# EAGLE design espThrottle (EAGLE 9.6.2)
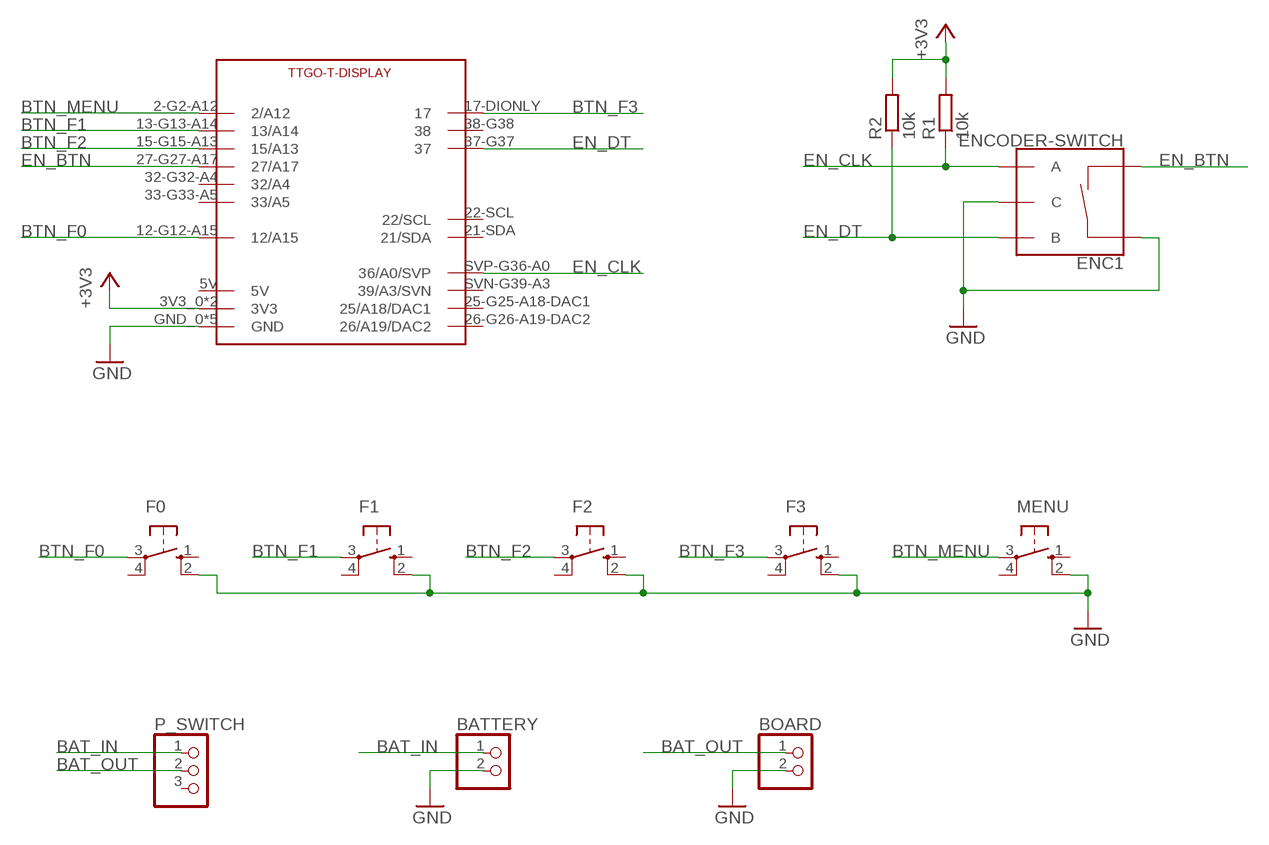
[diagram p0: schematic, sheet 1]

## Parts
BATTERY  PINHD-1X2  [1X02]
BOARD  PINHD-1X2  [1X02]
ENC1  ENCODER-SWITCH  [ROTARY_ENC_PLAIN]
F0  10-XX  [B3F-10XX]
F1  10-XX  [B3F-10XX]
F2  10-XX  [B3F-10XX]
F3  10-XX  [B3F-10XX]
MENU  10-XX  [B3F-10XX]
P_SWITCH  PINHD-1X3  [1X03]
R1  10k  R-EU_0207/12  [0207/12]
R2  10k  R-EU_0207/12  [0207/12]
U$1  TTGO-T-DISPLAYFRAME  [TTGO-T-DISPLAY-OL]

## Nets
+3V3: R1.2 R2.2 U$1.3V3_0(3V3) U$1.3V3_1(3V3)
BAT_IN: BATTERY.1 P_SWITCH.1
BAT_OUT: BOARD.1 P_SWITCH.2
BTN_F0: F0.3(P) U$1.12-G12-A15(12/A15)
BTN_F1: F1.3(P) U$1.13-G13-A14(13/A14)
BTN_F2: F2.3(P) U$1.15-G15-A13(15/A13)
BTN_F3: F3.3(P) U$1.17-DIONLY
BTN_MENU: MENU.3(P) U$1.2-G2-A12(2/A12)
EN_BTN: ENC1.SW- U$1.27-G27-A17(27/A17)
EN_CLK: ENC1.A R1.1 U$1.SVP-G36-A0(36/A0/SVP)
EN_DT: ENC1.B R2.1 U$1.37-G37
GND: BATTERY.2 BOARD.2 ENC1.C ENC1.SW+ F0.2(S1) F1.2(S1) F2.2(S1) F3.2(S1) MENU.2(S1) U$1.GND_0(GND) U$1.GND_1(GND) U$1.GND_2(GND) U$1.GND_3(GND) U$1.GND_4(GND)
Unconnected: F0.1(S) F0.4(P1) F1.1(S) F1.4(P1) F2.1(S) F2.4(P1) F3.1(S) F3.4(P1) MENU.1(S) MENU.4(P1) P_SWITCH.3 U$1.21-SDA(21/SDA) U$1.22-SCL(22/SCL) U$1.25-G25-A18-DAC1(25/A18/DAC1) U$1.26-G26-A19-DAC2(26/A19/DAC2) U$1.32-G32-A4(32/A4) U$1.33-G33-A5(33/A5) U$1.38-G38 U$1.SVN-G39-A3(39/A3/SVN)

## Power pins joined to a net without a drawn wire
5V: U$1.5V

## Library data of the parts
BATTERY BOARD = pinhead:PINHD-1X2: PIN HEADER
ENC1 = SparkFun-Switches:ENCODER-SWITCH: Rotary Encoder w/ Select Switch Encoders rotate similarly to potentiometers, but they’re different from potentiometers in that an encoder has full rotation without limits. They output gray code so that you can tell how much and in which direction the encoder has been turned. This encoder includes a push-down select switch built into the shaft. SparkFun Products Rotary Encoder <https://www.sparkfun.com/products/9117> (COM-09117); SF_SKU: COM-09117
F0 F1-F3 MENU = switch-omron:10-XX: OMRON SWITCH; MPN: B3F-1000; OC_FARNELL: 176432; OC_NEWARK: 36M3542
P_SWITCH = pinhead:PINHD-1X3: PIN HEADER
R1 R2 = rcl:R-EU_: RESISTOR, European symbol; SPICEPREFIX: R
U$1 = TTGO-TDisplay:TTGO-T-DISPLAY: TTGO-TDisplay https://github.com/Xinyuan-LilyGO/TTGO-T-Display

## Net classes
0 default: width 0.254 mm

## Board
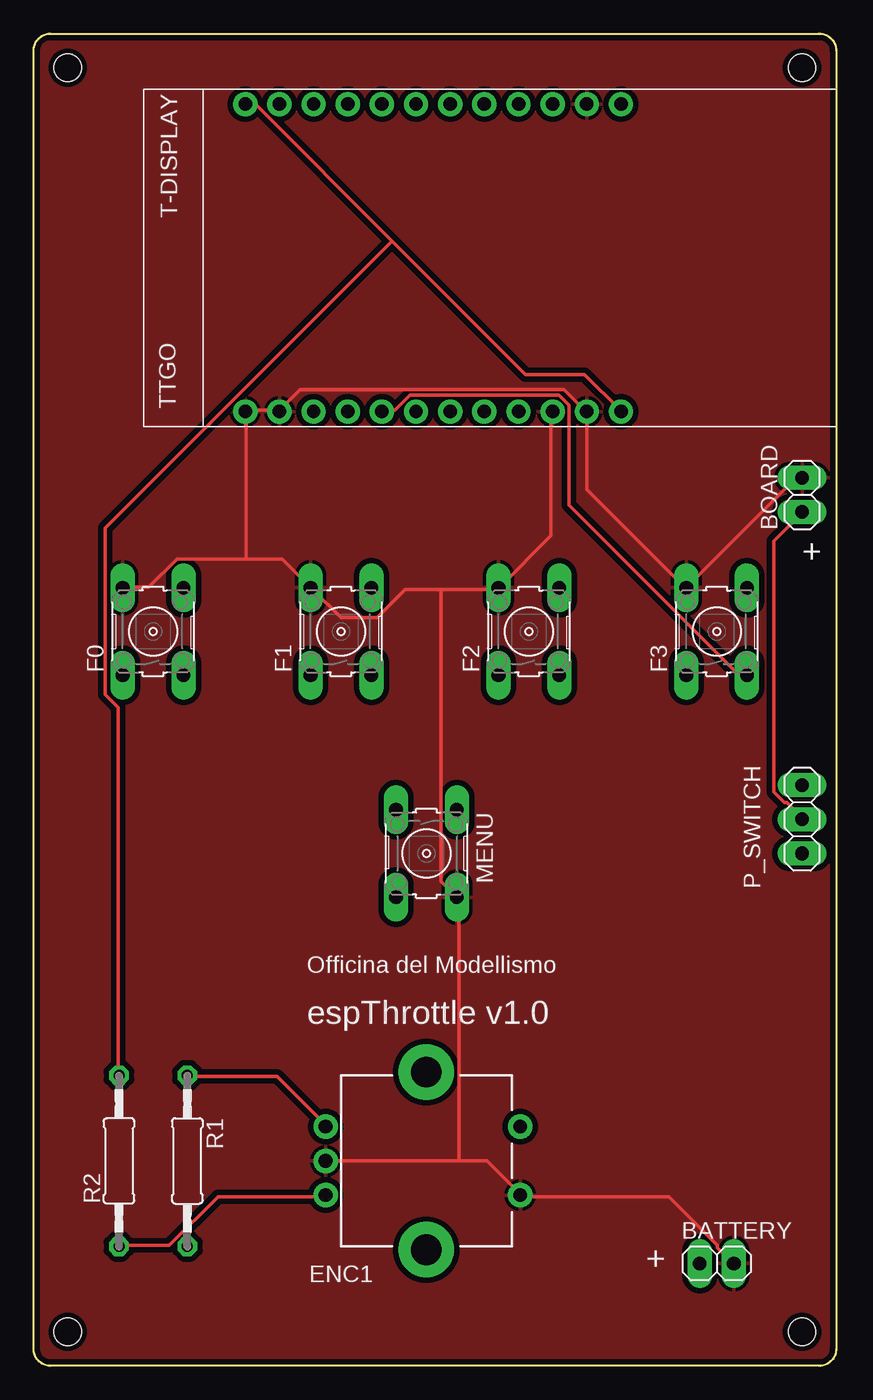
[diagram p1: board, top side]
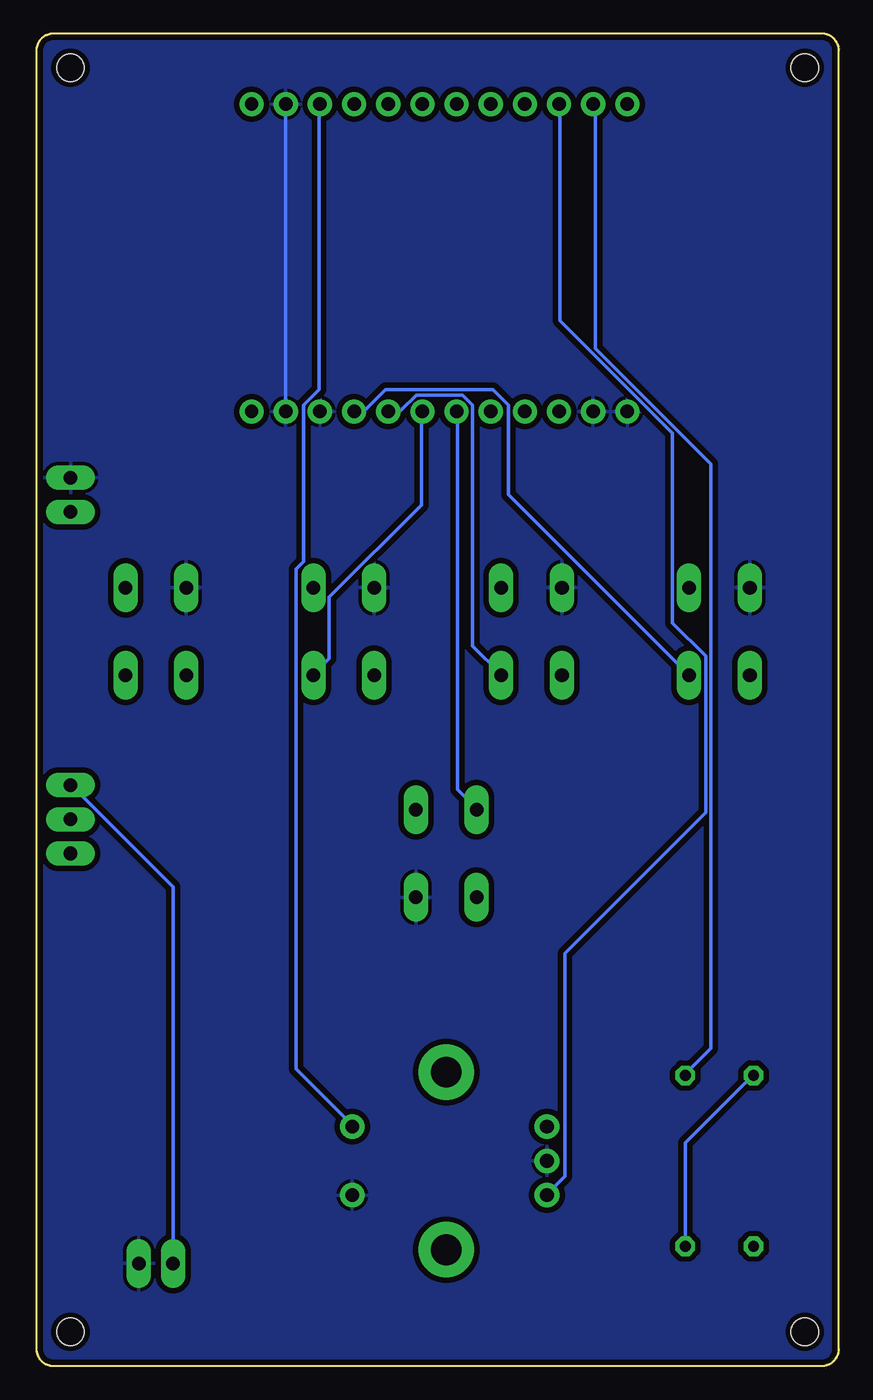
[diagram p2: board, bottom side, seen from below]

Size 59.69 x 99.06 mm. Coordinates in mm from the lower left corner, seen from the top.
Outline: 0,97.79 arc-90 1.27,99.06 58.42,99.06 arc-90 59.69,97.79 59.69,1.27 arc-90 58.42,0 1.27,0 arc-90 0,1.27 0,97.79
Copper layers (1*16): Top 0.035mm / dielectric 1.6mm / Bottom 0.035mm
Design rules "jlcpcb-2layers": minimum track width 5mil, minimum drill 0.3mm, track to track 5mil, track to pad 5mil, pad to pad 5mil, via to via 5mil, smd to smd 5mil, copper to edge 0.2mm, drill to drill 6mil, minimum pad ring 10mil, minimum via ring 3mil, stop-mask expansion 4mil, vias tented up to drill 0mil, thermal gap 10mil
Holes 2.03 mm at 2.54,2.54 2.54,96.52 57.15,96.52 57.15,2.54

### Footprints (pad centres in the part's own frame; a part is rotated, then mirrored left to right if it is on the bottom)
1X02 = drill 1.016 long: 1 -1.27,0; 2 1.27,0
ROTARY_ENC_PLAIN = drill 1.016: A 7.493,-2.54; B 7.493,2.54; C 7.493,0; SW+ -6.985,2.54; SW- -6.985,-2.54 | drill 2.286: P$3 0,6.604; P$4 0,-6.604
B3F-10XX = drill 1.016 long: 1 -3.251,2.261; 2 3.251,2.261; 3 -3.251,-2.261; 4 3.251,-2.261
1X03 = drill 1.016 long: 1 -2.54,0; 2 0,0; 3 2.54,0
0207/12 = drill 0.813 octagon: 1 -6.35,0; 2 6.35,0
TTGO-T-DISPLAY-OL = drill 1 pad 1.78: 2-G2-A12 1.11,31.25; 3V3_0 1.11,16.01; 3V3_1 23.97,43.95; 5V 23.97,16.01; 12-G12-A15 1.11,23.63; 13-G13-A14 1.11,26.17; 15-G15-A13 1.11,28.71; 17-DIONLY 1.11,33.79; 21-SDA 1.11,38.87; 22-SCL 1.11,36.33; 25-G25-A18-DAC1 23.97,26.17; 26-G26-A19-DAC2 23.97,23.63; 27-G27-A17 23.97,21.09; 32-G32-A4 23.97,31.25; 33-G33-A5 23.97,28.71; 37-G37 23.97,38.87; 38-G38 23.97,36.33; GND_0 1.11,43.95; GND_1 1.11,41.41; GND_2 1.11,21.09; GND_3 1.11,18.55; GND_4 23.97,18.55; SVN-G39-A3 23.97,33.79; SVP-G36-A0 23.97,41.41

### Placement (x,y rotation side)
BATTERY  50.8,7.62 0 top
BOARD  57.15,64.77 90 top
ENC1  29.21,15.24 180 top
F0  8.89,54.61 90 top
F1  22.86,54.61 90 top
F2  36.83,54.61 90 top
F3  50.8,54.61 90 top
MENU  29.21,38.1 270 top
P_SWITCH  57.15,40.64 270 top
R1  11.43,15.24 270 top
R2  6.35,15.24 90 top
U$1  59.69,69.85 90 top

### Tracks (layer width: path | path; a pad name or v marks a point on that pad's centre or on a via)
+3V3
  Top 0.254: 26.67,83.63 36.58,73.72 40.96,73.72 43.62,71.06 U$1.3V3_0 | 26.67,83.63 16.57,93.73 15.81,93.73 U$1.3V3_1 | 26.67,83.63 5.33,62.29 5.33,49.91 6.29,48.96 6.29,21.72 R2.2
  Bottom 0.254: R1.2 11.43,16.57 6.48,21.53 R2.2
BAT_IN
  Bottom 0.254: BATTERY.1 49.53,35.62 57.15,43.24 P_SWITCH.1
BAT_OUT
  Top 0.254: P_SWITCH.2 57.15,40.77 56.01,41.91 55.82,41.91 55.05,42.67 55.05,61.34 57.15,63.44 BOARD.1
BTN_F0
  Bottom 0.254: U$1.12-G12-A15 36,71.06 35.24,71.06 33.72,72.58 25.72,72.58 24.57,71.44 24.57,64.77 11.24,51.44 F0.3
BTN_F1
  Bottom 0.254: U$1.13-G13-A14 33.34,71.06 32.58,71.06 31.43,72.2 28,72.2 27.24,71.44 27.24,53.53 25.15,51.44 F1.3
BTN_F2
  Bottom 0.254: U$1.15-G15-A13 31.05,70.87 31.05,64.01 37.91,57.15 37.91,52.58 39.05,51.44 F2.3
BTN_F3
  Top 0.254: U$1.17-DIONLY 25.91,71.06 26.86,71.06 28,72.2 39.05,72.2 39.82,71.44 39.82,64.01 52.39,51.44 52.96,51.44 F3.3
BTN_MENU
  Bottom 0.254: U$1.2-G2-A12 28.38,70.87 28.38,42.86 27.05,41.53 MENU.3
EN_BTN
  Bottom 0.254: U$1.27-G27-A17 38.67,93.73 38.67,72.58 39.82,71.44 39.82,59.82 40.39,59.24 40.39,22.1 36.2,17.91 ENC1.SW-
EN_CLK
  Top 0.254: R1.1 11.43,21.53 18.1,21.53 21.72,17.91 ENC1.A
  Bottom 0.254: U$1.SVP-G36-A0 18.1,93.73 18.1,75.63 9.53,67.06 9.53,23.62 11.43,21.72 R1.1
EN_DT
  Top 0.254: R2.1 6.48,8.95 10.1,8.95 13.72,12.57 21.72,12.57 ENC1.B
  Bottom 0.254: U$1.37-G37 20.76,93.73 20.76,77.72 12.38,69.34 12.38,55.24 9.91,52.77 9.91,41.15 20.38,30.67 20.38,14.1 21.72,12.76 ENC1.B
GND
  Top 0.254: BOARD.2 57.15,65.91 56.58,65.91 48.58,57.91 F3.2 48.39,57.91 41.15,65.15 41.15,70.87 U$1.GND_3 40.96,71.06 39.43,72.58 19.81,72.58 18.29,71.06 U$1.GND_1 18.1,71.06 15.81,71.06 U$1.GND_0 15.81,70.87 15.81,60.01 | U$1.GND_2 38.48,70.87 38.48,61.72 34.67,57.91 F2.2 34.48,57.72 30.29,57.72 | 15.81,60.01 18.48,60.01 20.57,57.91 F1.2 20.76,57.72 22.86,55.63 25.53,55.63 27.62,57.72 30.29,57.72 | 15.81,60.01 10.67,60.01 8.57,57.91 6.67,57.91 F0.2 | 31.62,15.24 33.72,15.24 36.2,12.76 ENC1.SW+ 36.2,12.57 47.24,12.57 50.86,8.95 50.86,8.76 52.01,7.62 BATTERY.2 | 31.62,15.24 ENC1.C | 31.62,15.24 31.62,34.67 MENU.2 31.43,34.86 30.29,36.01 30.29,57.72
  Bottom 0.254: U$1.GND_4 41.15,93.73 41.15,71.06 U$1.GND_3
  pour Top (isolate 0.406): 0,99.06 59.69,99.06 59.69,0 0,0
  pour Bottom (isolate 0.406): 0,99.06 59.69,99.06 59.69,0 0,0

### Text on the board
tPlace: + | Officina del Modellismo | espThrottle v1.0 | +